# Altium schematic sheet changelist.SchDoc
size A2
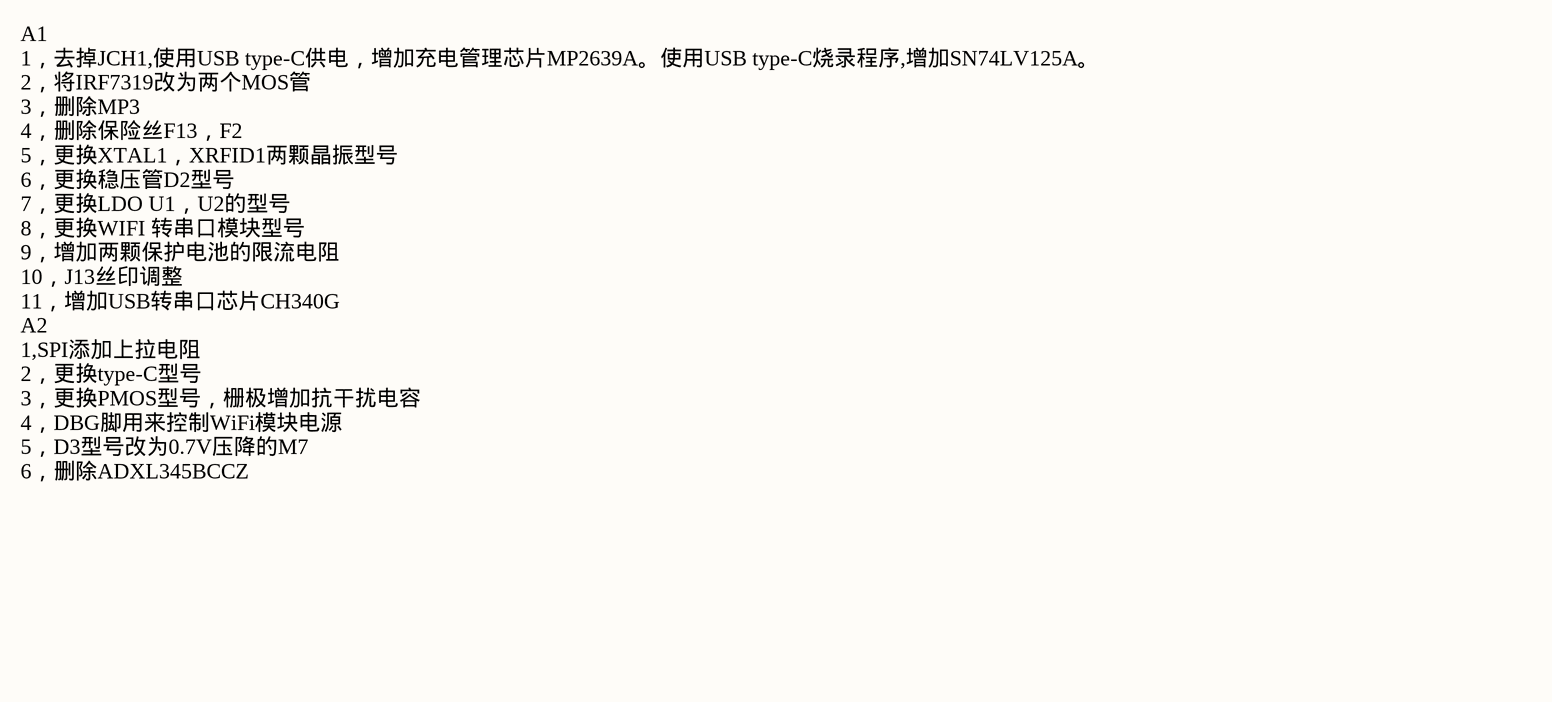
[diagram p0: changelist.SchDoc]

## Notes on the sheet
- A1
  1，去掉JCH1,使用USB type-C供电，增加充电管理芯片MP2639A。使用USB type-C烧录程序,增加SN74LV125A。
  2，将IRF7319改为两个MOS管
  3，删除MP3
  4，删除保险丝F13，F2
  5，更换XTAL1，XRFID1两颗晶振型号
  6，更换稳压管D2型号
  7，更换LDO U1，U2的型号
  8，更换WIFI 转串口模块型号
  9，增加两颗保护电池的限流电阻
  10，J13丝印调整
  11，增加USB转串口芯片CH340G
  A2
  1,SPI添加上拉电阻
  2，更换type-C型号
  3，更换PMOS型号，栅极增加抗干扰电容
  4，DBG脚用来控制WiFi模块电源
  5，D3型号改为0.7V压降的M7
  6，删除ADXL345BCCZ